# EAGLE design Page1 (EAGLE 4.16)
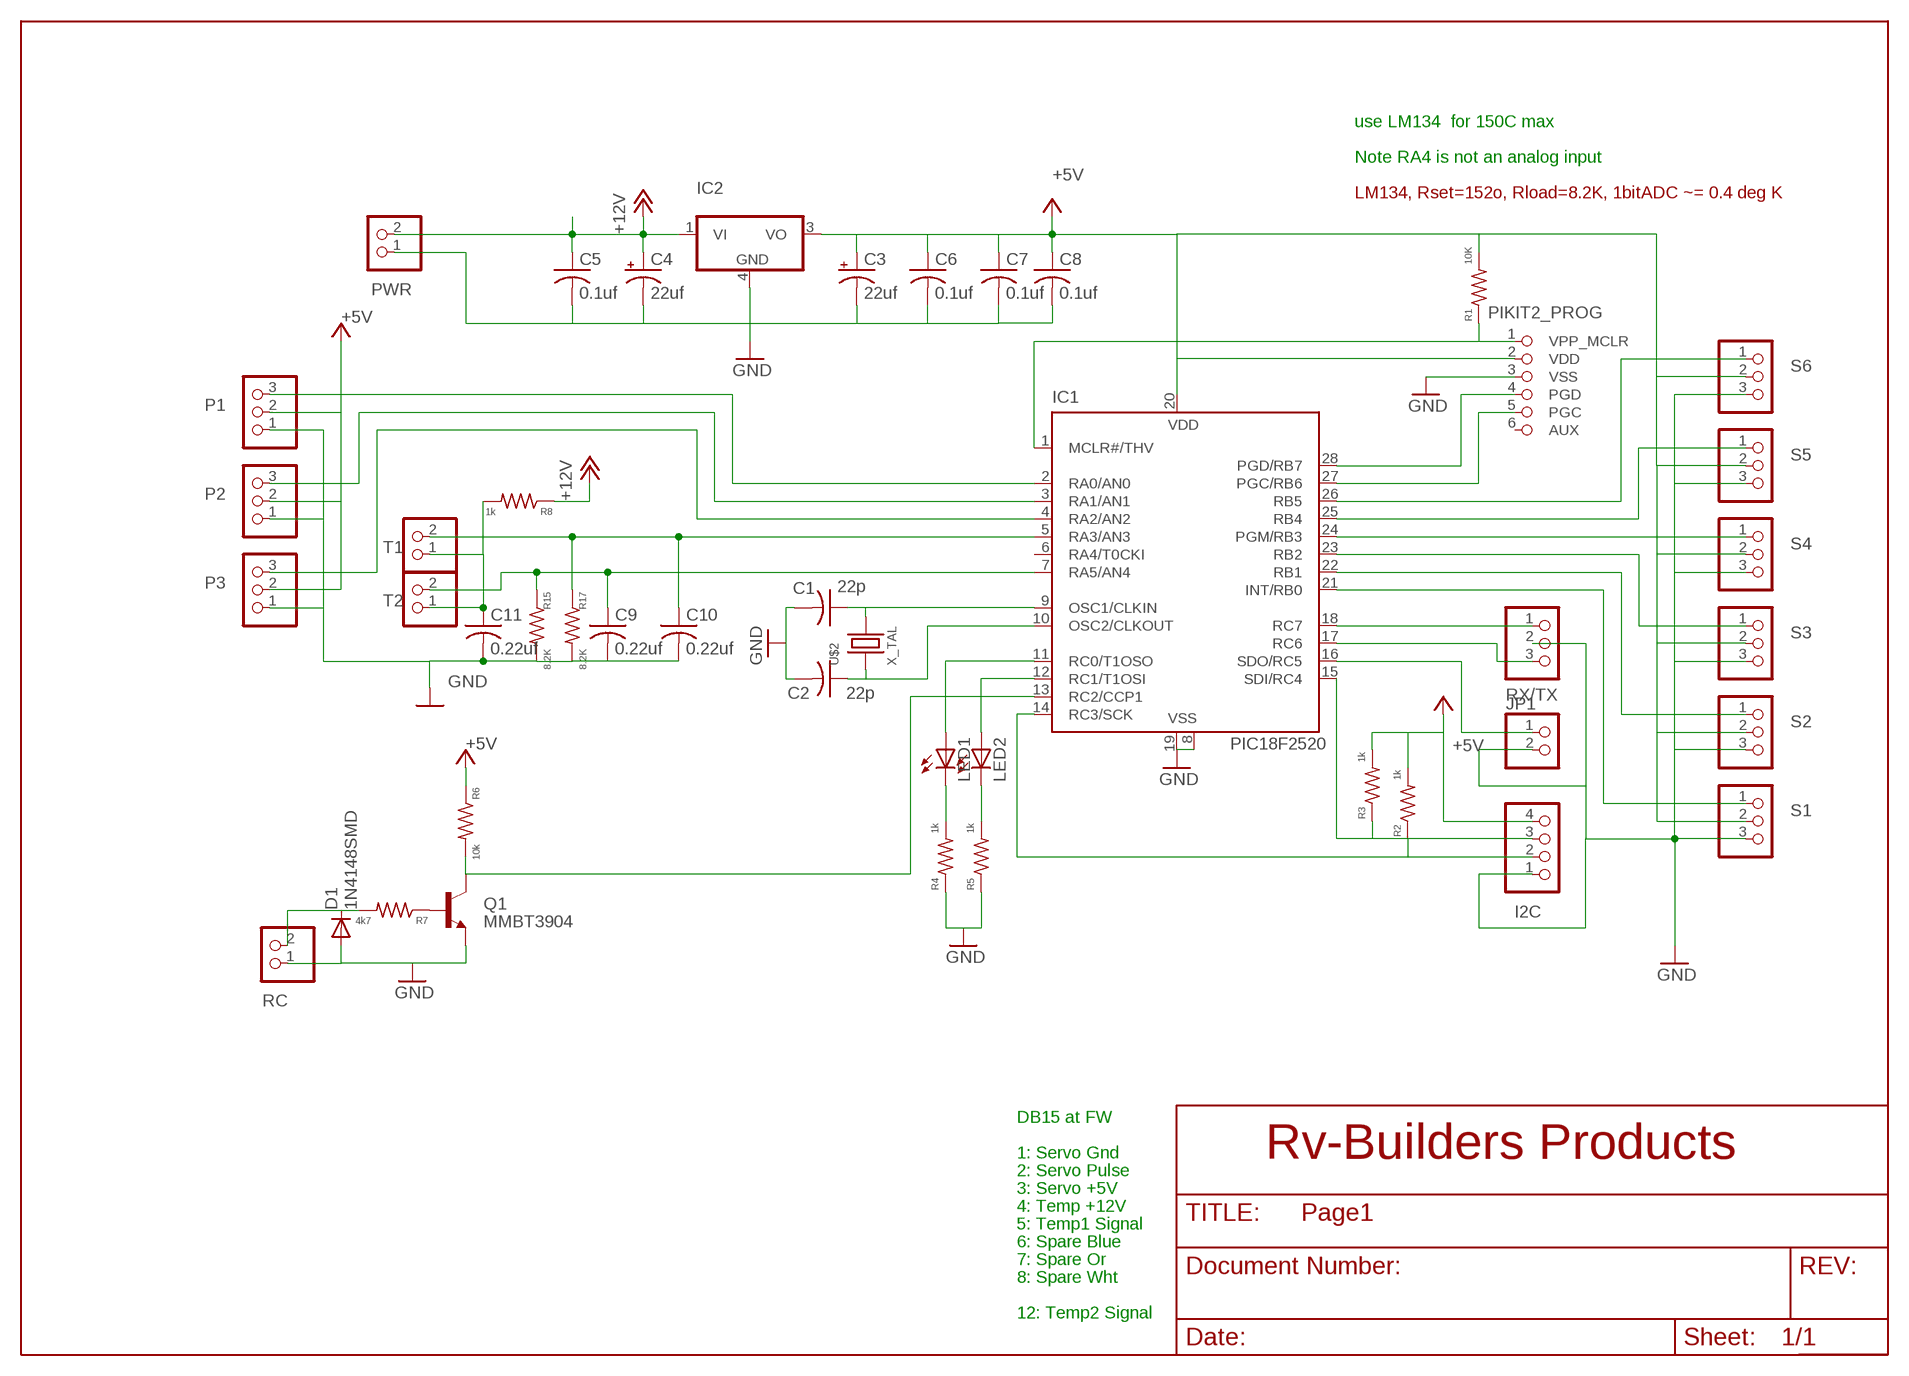
[diagram p0: schematic, sheet 1]

## Parts
C1  22p  C-USC0603  [C0603]
C2  22p  C-USC0603  [C0603]
C3  22uf  CPOL-USSMCD  [SMC_D]
C4  22uf  CPOL-USSMCD  [SMC_D]
C5  0.1uf  C-USC0805  [C0805]
C6  0.1uf  C-USC0805  [C0805]
C7  0.1uf  C-USC0805  [C0805]
C8  0.1uf  C-USC0805  [C0805]
C9  0.22uf  C-USC0805  [C0805]
C10  0.22uf  C-USC0805  [C0805]
C11  0.22uf  C-USC0805  [C0805]
D1  1N4148SMD  [SOD123]
I2C  PINHD-1X4  [1X04]
IC1  PIC18F2520  PIC16876P  [DIL28-3]
IC2  78MXXL  [DPACK]
JP1  PINHD-1X2  [1X02]
LED1  LEDCHIP-LED0805  [CHIP-LED0805]
LED2  LEDCHIP-LED0805  [CHIP-LED0805]
P1  PINHD-1X3  [1X03]
P2  PINHD-1X3  [1X03]
P3  PINHD-1X3  [1X03]
PIKIT2_PROG  PIKIT2_PRG  [1X06]
PWR  PINHD-1X2  [1X02]
Q1  MMBT3904  BC846B-NPN-SOT23-BEC  [SOT23-BEC]
R1  10K  R-US_R0805  [R0805]
R2  1k  R-US_R0603  [R0603]
R3  1k  R-US_R0603  [R0603]
R4  1k  R-US_R0805  [R0805]
R5  1k  R-US_R0805  [R0805]
R6  10k  R-US_R0805  [R0805]
R7  4k7  R-US_R0805  [R0805]
R8  1k  R-US_0207/10  [0207/10]
R15  8.2K  R-US_R0805  [R0805]
R17  8.2K  R-US_R0805  [R0805]
RC  PINHD-1X2  [1X02]
RX/TX  PINHD-1X3  [1X03]
S1  PINHD-1X3  [1X03]
S2  PINHD-1X3  [1X03]
S3  PINHD-1X3  [1X03]
S4  PINHD-1X3  [1X03]
S5  PINHD-1X3  [1X03]
S6  PINHD-1X3  [1X03]
T1  PINHD-1X2  [1X02]
T2  PINHD-1X2  [1X02]
U$2  X_TAL  [HC49/S]

## Nets
+5V: C3.+ C6.1 C7.1 C8.1 I2C.4 IC1.20(VDD) IC2.3(VO) P1.2 P2.2 P3.2 PIKIT2_PROG.2(VDD) R1.2 R2.2 R3.2 R6.1 S1.2 S2.2 S3.2 S4.2 S5.2 S6.2
+12V: C4.+ C5.1 IC2.1(VI) PWR.2 R8.1
GND: C1.2 C2.2 C3.- C4.- C5.2 C6.2 C7.2 C8.2 C9.2 C10.2 C11.2 D1.A I2C.1 IC1.8(VSS) IC1.19(VSS) IC2.4(GND) JP1.2 P1.1 P2.1 P3.1 PIKIT2_PROG.3(VSS) PWR.1 Q1.E R4.1 R5.1 R15.2 R17.2 RC.1 RX/TX.2 S1.3 S2.3 S3.3 S4.3 S5.3 S6.3
N$1: IC1.22(RB1) S2.1
N$2: IC1.28(PGD/RB7) PIKIT2_PROG.4(PGD)
N$3: IC1.27(PGC/RB6) PIKIT2_PROG.5(PGC)
N$4: IC1.23(RB2) S3.1
N$5: IC1.1(MCLR#/THV) PIKIT2_PROG.1(VPP_MCLR) R1.1
N$6: IC1.24(PGM/RB3) S4.1
N$7: LED2.C R5.2
N$8: IC1.21(INT/RB0) S1.1
N$9: LED1.C R4.2
N$10: IC1.25(RB4) S5.1
N$11: IC1.16(SDO/RC5) JP1.1
N$12: IC1.26(RB5) S6.1
N$13: IC1.18(RC7) RX/TX.1
N$14: IC1.17(RC6) RX/TX.3
N$15: IC1.13(RC2/CCP1) Q1.C R6.2
N$16: C1.1 IC1.9(OSC1/CLKIN) U$2.2
N$17: C2.1 IC1.10(OSC2/CLKOUT) U$2.1
N$18: C9.1 IC1.7(RA5/AN4) R15.1 T2.2
N$19: IC1.2(RA0/AN0) P1.3
N$20: C11.1 R8.2 T1.1 T2.1
N$23: I2C.2 IC1.14(RC3/SCK) R2.1
N$24: C10.1 IC1.5(RA3/AN3) R17.1 T1.2
N$25: Q1.B R7.1
N$26: IC1.11(RC0/T1OSO) LED1.A
N$27: IC1.12(RC1/T1OSI) LED2.A
N$30: I2C.3 IC1.15(SDI/RC4) R3.1
N$31: D1.C R7.2 RC.2
N$32: IC1.3(RA1/AN1) P2.3
N$33: IC1.4(RA2/AN2) P3.3
Unconnected: IC1.6(RA4/T0CKI) PIKIT2_PROG.6(AUX)

## Notes on the sheet
- use LM134  for 150C max
- Note RA4 is not an analog input
- LM134, Rset=152o, Rload=8.2K, 1bitADC ~= 0.4 deg K
- DB15 at FW
- 1: Servo Gnd
- 2: Servo Pulse
- 3: Servo +5V
- 4: Temp +12V
- 5: Temp1 Signal
- 6: Spare Blue
- 7: Spare Or
- 8: Spare Wht
- 12: Temp2 Signal

## Library data of the parts
C1 C2 C5-C11 = rcl:C-US: CAPACITOR, American symbol
C3 C4 = rcl:CPOL-US: POLARIZED CAPACITOR, American symbol
D1 = Stofer:1N4148: DIODE high speed (Philips)
I2C = Headers:PINHD-1X4: PIN HEADER
IC1 = microchip:PIC16*876: MICROCONTROLLER flash type
IC2 = Stofer:78MXXL: VOLTAGE REGULATOR
JP1 PWR RC = Headers:PINHD-1X2: PIN HEADER
LED1 LED2 = led:LED: LED OSRAM: - CHIPLED LG R971, LG N971, LY N971, LG Q971, LY Q971, LO R971, LY R971 LH N974, LH R974 LS Q976, LO Q976, LY Q976 LO Q996 - Hyper CHIPLED LW Q18S LB Q993, LB Q99A, LB R99A - SideLED LS A670, LO A670, LY A670, LG A670, LP A670 LB A673, LV A673, LT A673, LW A673 LH A674 LY A675 LS A676, LA A676, LO A676, LY A676, LW A676 LS A679, LY A679, LG A679 - Hyper Micro SIDELED® LS Y876, LA Y876, LO Y876, LY Y876 LT Y87S - SmartLED LW L88C, LW L88S LB L89C, LB L89S, LG L890 LS L89K, LO L89K, LY L89K LS L896, LA L896, LO L896, LY L896 - TOPLED LS T670, LO T670, LY T670, LG T670, LP T670 LSG T670, LSP T670, LSY T670, LOP T670, LYG T670 LG T671, LOG T671, LSG T671 LB T673, LV T673, LT T673, LW T673 LH T674 LS T676, LA T676, LO T676, LY T676, LB T676, LH T676, LSB T676, LW T676 LB T67C, LV T67C, LT T67C, LS T67K, LO T67K, LY T67K, LW E67C LS E67B, LA E67B, LO E67B, LY E67B, LB E67C, LV E67C, LT E67C LW T67C LS T679, LY T679, LG T679 LS T770, LO T770, LY T770, LG T770, LP T770 LB T773, LV T773, LT T773, LW T773 LH T774 LS E675, LA E675, LY E675, LS T675 LS T776, LA T776, LO T776, LY T776, LB T776 LHGB T686 LT T68C, LB T68C - Hyper Mini TOPLED® LB M676 - Mini TOPLED Santana® LG M470 LS M47K, LO M47K, LY M47K Source: http://www.osram.convergy.de - LUMILED® LXK2-PW12-R00, LXK2-PW12-S00, LXK2-PW14-U00, LXK2-PW14-V00 LXK2-PM12-R00, LXK2-PM12-S00, LXK2-PM14-U00 LXK2-PE12-Q00, LXK2-PE12-R00, LXK2-PE12-S00, LXK2-PE14-T00, LXK2-PE14-U00 LXK2-PB12-K00, LXK2-PB12-L00, LXK2-PB12-M00, LXK2-PB14-N00, LXK2-PB14-P00, LXK2-PB14-Q00 LXK2-PR12-L00, LXK2-PR12-M00, LXK2-PR14-Q00, LXK2-PR14-R00 LXK2-PD12-Q00, LXK2-PD12-R00, LXK2-PD12-S00 LXK2-PH12-R00, LXK2-PH12-S00 LXK2-PL12-P00, LXK2-PL12-Q00, LXK2-PL12-R00 Source: www.luxeon.com
P1-P3 = Stofer:PINHD-1X3: PIN HEADER
PIKIT2_PROG = Stofer:PIKIT2_PRG: PIN HEADER
Q1 = transistor:*-NPN-: NPN Transistror
R1-R8 R15 R17 = rcl:R-US_: RESISTOR, American symbol
RX/TX S1-S6 = Headers:PINHD-1X3: PIN HEADER
T1 T2 = Stofer:PINHD-1X2: PIN HEADER
U$2 = Stofer:X_TAL

## Board
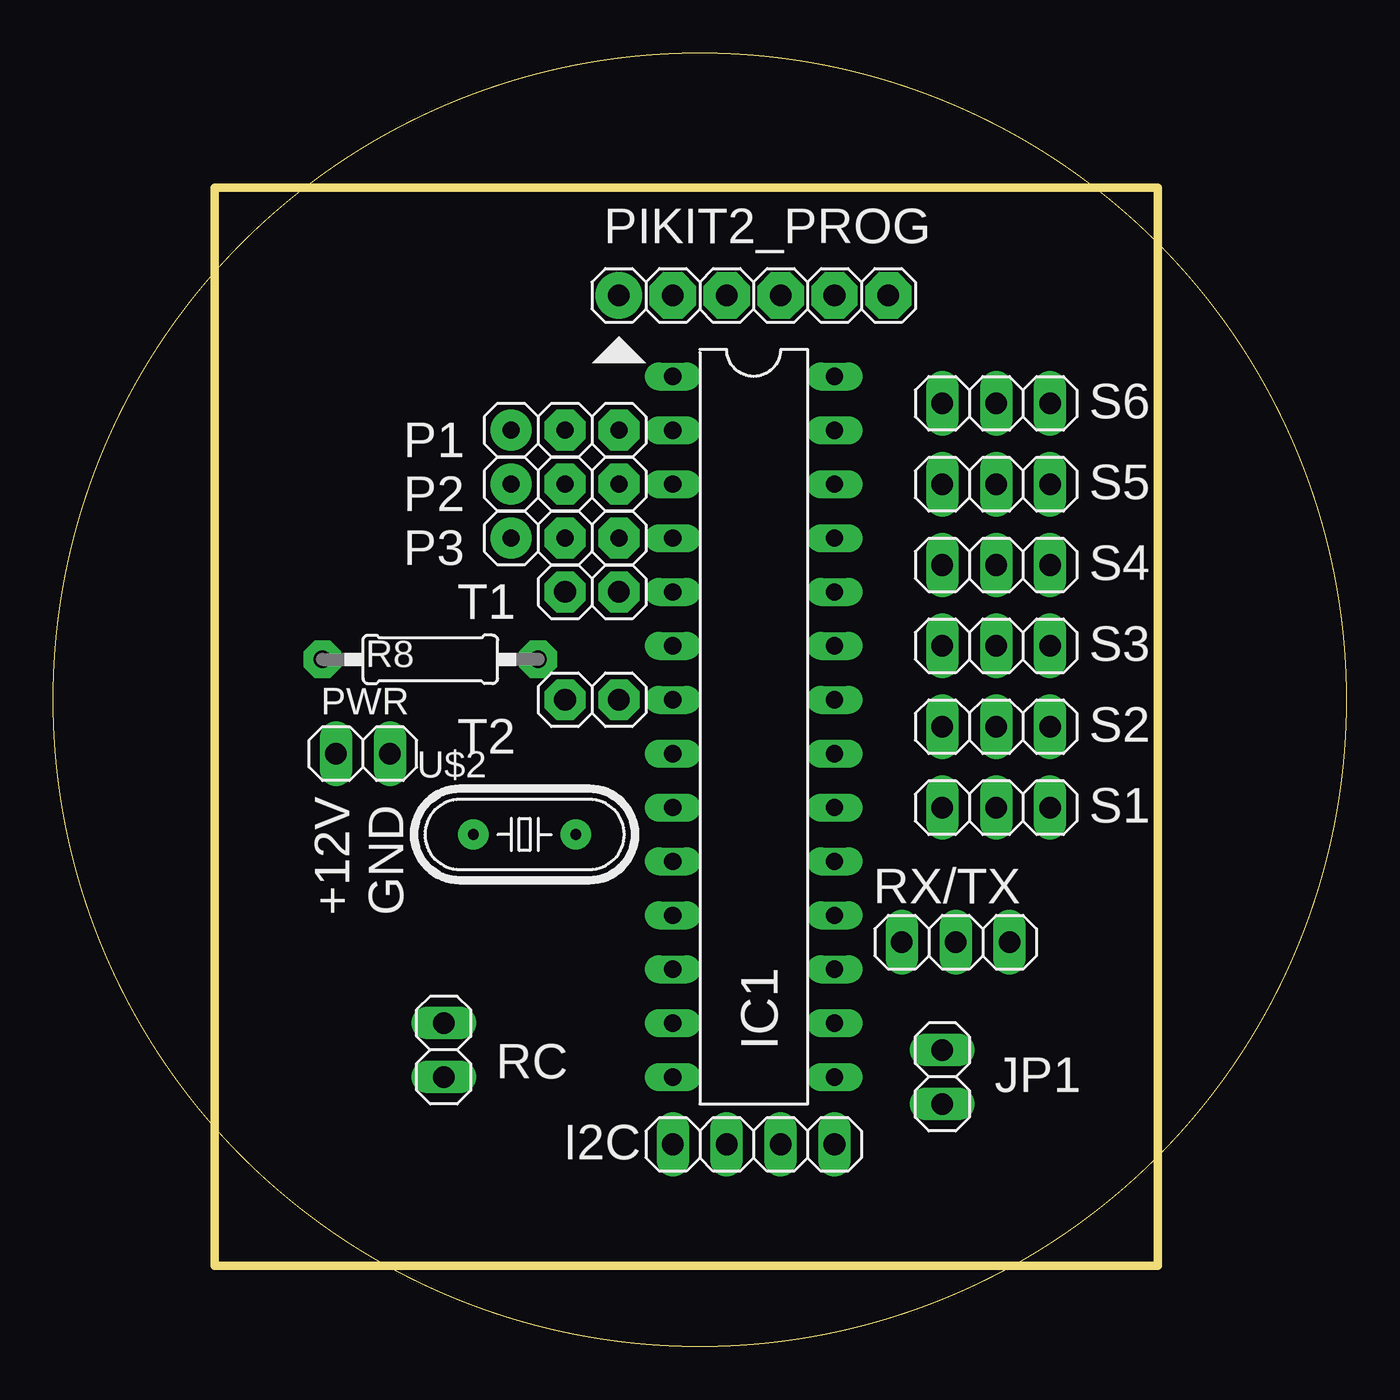
[diagram p1: board, top side]
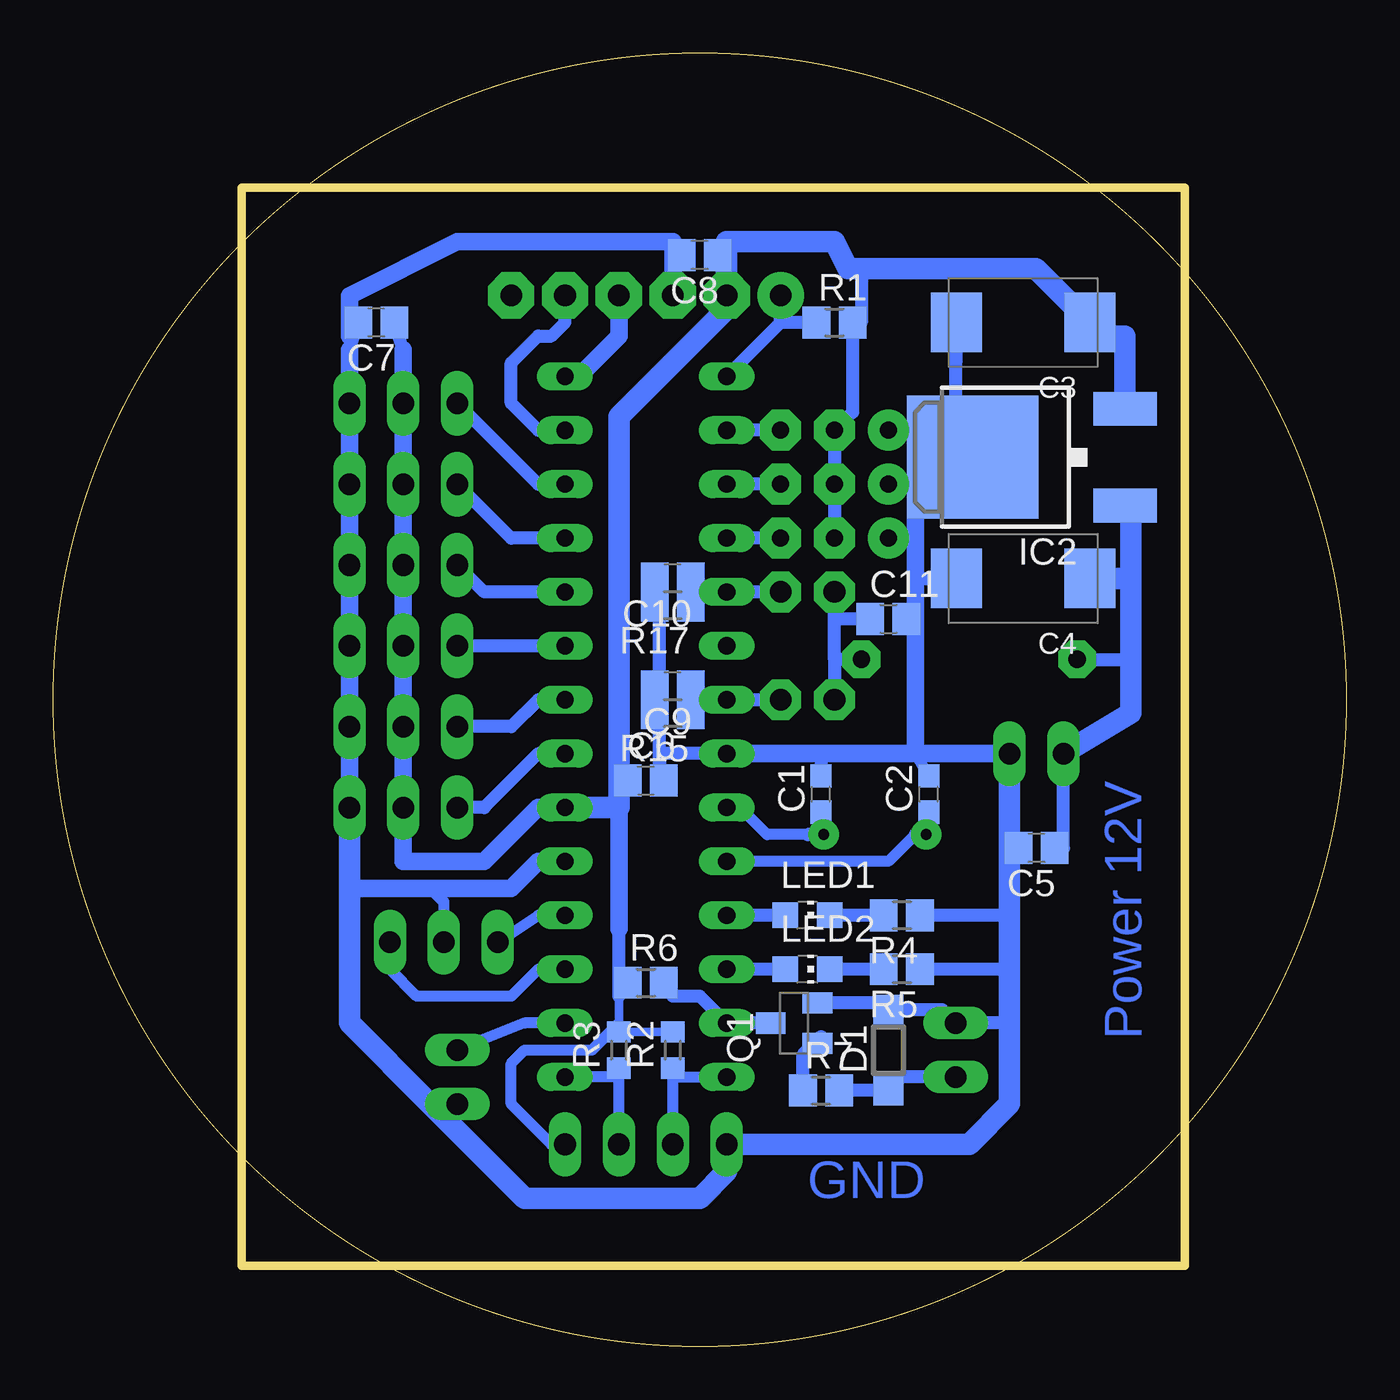
[diagram p2: board, bottom side, seen from below]

Size 60.96 x 60.96 mm. Coordinates in mm from the lower left corner, seen from the top.
Outline: 52.07,3.81 52.07,54.61 7.62,54.61 7.62,3.81 52.07,3.81
Outline: circle at 30.48,30.48 radius 30.48
Copper layers (1*16): Top 0.035mm / dielectric 0.2mm / Bottom 0.035mm
Design rules "default": minimum track width 10mil, minimum drill 20mil, track to track 8mil, track to pad 8mil, pad to pad 8mil, via to via 8mil, smd to smd 8mil, copper to edge 40mil, drill to drill 8mil, minimum pad ring 10mil, minimum via ring 8mil, stop-mask expansion 4mil, vias tented up to drill 0mil, thermal gap 10mil

### Footprints (pad centres in the part's own frame; a part is rotated, then mirrored left to right if it is on the bottom)
C0603 = smd 1.1 x 1: 1 -0.85,0; 2 0.85,0
SMC_D = smd 2.4 x 2.8: + -3.15,0; - 3.15,0
C0805 = smd 1.3 x 1.5: 1 -0.85,0; 2 0.85,0
SOD123 = smd 1.4 x 1.4: A 1.9,0; C -1.9,0
1X04 = drill 1.016 long: 1 -3.81,0; 2 -1.27,0; 3 1.27,0; 4 3.81,0
DIL28-3 = drill 0.813 long: 1 -16.51,-3.81; 2 -13.97,-3.81; 3 -11.43,-3.81; 4 -8.89,-3.81; 5 -6.35,-3.81; 6 -3.81,-3.81; 7 -1.27,-3.81; 8 1.27,-3.81; 9 3.81,-3.81; 10 6.35,-3.81; 11 8.89,-3.81; 12 11.43,-3.81; 13 13.97,-3.81; 14 16.51,-3.81; 15 16.51,3.81; 16 13.97,3.81; 17 11.43,3.81; 18 8.89,3.81; 19 6.35,3.81; 20 3.81,3.81; 21 1.27,3.81; 22 -1.27,3.81; 23 -3.81,3.81; 24 -6.35,3.81; 25 -8.89,3.81; 26 -11.43,3.81; 27 -13.97,3.81; 28 -16.51,3.81
DPACK = smd 1.6 x 3: 1 -2.28,-4.8; 3 2.28,-4.8 | smd 5.8 x 6.2: 4 0,2.38
1X02 = drill 1.016 long: 1 -1.27,0; 2 1.27,0
CHIP-LED0805 = smd 1.2 x 1.2: A 0,-1.05; C 0,1.05
1X03 = drill 0.8 pad 1.93 round: 1 -2.54,0 | drill 0.8 pad 1.93 octagon: 2 0,0; 3 2.54,0
1X06 = drill 1.016 pad 2.184 round: 1 -6.35,0 | drill 1.016 pad 2.184 octagon: 2 -3.81,0; 3 -1.27,0; 4 1.27,0; 5 3.81,0; 6 6.35,0
SOT23-BEC = smd 1 x 1.4: B -0.95,-1.1; C 0,1.1; E 0.95,-1.1
R0805 = smd 1.3 x 1.5: 1 -0.85,0; 2 0.85,0
R0603 = smd 1 x 1.1: 1 -0.85,0; 2 0.85,0
0207/10 = drill 0.813 pad 1.778 octagon: 1 -5.08,0; 2 5.08,0
1X03' = drill 1.016 long: 1 -2.54,0; 2 0,0; 3 2.54,0
1X02' = drill 1.016 pad 1.93 octagon: 1 -1.27,0; 2 1.27,0
HC49/S = drill 0.5 pad 1.422 round: 1 -2.413,0; 2 2.413,0

### Placement (x,y rotation side)
C1  24.76,26.03 90 bottom
C2  19.68,26.03 90 bottom
C3  15.24,48.26 180 bottom
C4  15.24,36.19 180 bottom
C5  14.6,23.49 180 bottom
C6  33.02,26.67 0 bottom
C7  45.72,48.26 180 bottom
C8  30.48,51.44 180 bottom
C9  31.75,31.11 180 bottom
C10  31.75,36.19 180 bottom
C11  21.59,34.29 0 bottom
D1  21.59,13.97 90 bottom
I2C  33.02,9.52 0 top
IC1  33.02,29.21 270 top
IC2  15.24,41.91 90 bottom
JP1  41.91,12.7 270 top
LED1  25.4,20.32 270 bottom
LED2  25.4,17.78 270 bottom
P1  24.13,43.18 0 top
P2  24.13,40.64 0 top
P3  24.13,38.1 0 top
PIKIT2_PROG  33.02,49.53 0 top
PWR  14.6,27.94 180 top
Q1  26.04,15.24 90 bottom
R1  24.13,48.26 0 bottom
R2  31.75,13.97 90 bottom
R3  34.29,13.97 90 bottom
R4  20.96,20.32 180 bottom
R5  20.96,17.78 180 bottom
R6  33.02,17.14 0 bottom
R7  24.76,12.06 0 bottom
R8  17.78,32.38 0 top
R15  31.75,29.84 180 bottom
R17  31.75,34.92 180 bottom
RC  18.41,13.97 270 top
RX/TX  [1X03']  42.55,19.05 0 top
S1  [1X03']  44.45,25.4 0 top
S2  [1X03']  44.45,29.21 0 top
S3  [1X03']  44.45,33.02 0 top
S4  [1X03']  44.45,36.83 0 top
S5  [1X03']  44.45,40.64 0 top
S6  [1X03']  44.45,44.45 0 top
T1  [1X02']  25.4,35.56 0 top
T2  [1X02']  25.4,30.48 0 top
U$2  22.22,24.13 0 top

### Tracks (layer width: path | path; a pad name or v marks a point on that pad's centre or on a via)
+5V
  Bottom 0.406: R6.1 34.29,16.51 34.29,15.24 R3.2 | 34.29,27.94 C6.1 | R3.2 34.29,14.6 | R2.2 31.75,14.6 31.96,14.82 R3.2 | C8.1 29.21,51.44 29.21,52.07
  Bottom 0.508: I2C.4 37.47,9.52 39.37,11.43 39.37,13.33 38.73,13.97 35.56,13.97 34.29,15.24
  Bottom 0.61: 44.45,46.99 C7.1 | 12.06,47.62 11.43,48.26 | 34.29,16.51 34.29,19.68 | P3.2 P2.2 P1.2 23.28,44.03 R1.2 22.86,48.26 22.86,50.8 23.5,50.8
  Bottom 0.813: IC1.20 38.1,25.4 40.64,22.86 44.45,22.86 S1.2 S2.2 S3.2 S4.2 S5.2 S6.2 44.45,46.99 | 34.29,19.68 34.29,25.4 | C3.+ 12.06,47.62 | 29.21,48.89 PIKIT2_PROG.2
  Bottom 1.016: IC1.20 34.29,25.4 34.29,27.94 34.29,43.81 29.21,48.89 | PIKIT2_PROG.2 29.21,52.07 24.13,52.07 23.5,50.8 14.63,50.8 C3.+ | IC2.3 10.44,47.62 12.06,47.62
+12V
  Bottom 0.508: 10.16,39.63 IC2.1 | 10.16,38.1 10.16,37.47
  Bottom 0.61: C5.1 13.33,23.49 PWR.2 | R8.1 10.16,32.38
  Bottom 1.016: 10.16,39.63 10.16,38.1 10.16,36.19 | 10.16,36.19 10.16,32.38 10.16,29.84 PWR.2 | 10.16,36.19 C4.+
GND
  Bottom 0.406: 19.05,42.07 19.05,41.91 | 19.43,42.07 19.05,42.07 | 19.05,42.07 19.05,43.18 | 20.32,40.64 20.32,40.54 20.09,40.54 | C8.2 31.75,51.44 31.75,52.07
  Bottom 0.508: RX/TX.2 42.55,20.95 43.18,21.59 | R5.1 20.32,17.78 | R17.2 32.39,34.92 32.39,36.19 C10.2 | R15.2 32.39,29.84 32.39,31.11 | 20.32,27.94 C2.2
  Bottom 0.61: 22.22,27.94 21.59,27.94 | S2.3 S3.3 | Q1.E 21.9,16.19 D1.A 19.04,15.87 | 46.99,46.99 C7.2 46.99,47.62 | 20.32,40 20.09,40.54 19.43,42.07 18.41,44.45 C3.- | 24.76,27.94 C1.2 | C10.2 32.39,35.56 32.39,34.92 32.39,31.11 | IC1.8 32.39,27.94 32.39,27.3 | C6.2 32.39,26.67 32.39,27.3 | 32.39,30.48 32.39,29.84 | 32.39,30.48 32.39,31.11 | 32.39,31.11 C9.2 | 32.39,27.3 32.39,30.48 | 15.87,17.78 R5.1 | 15.87,15.24 RC.1 19.04,15.87 | 19.04,15.87 19.05,15.87 | 19.05,43.18 P1.1 | 20.32,40.64 P2.1 | 20.32,38.1 P3.1 | 15.87,20.32 R4.1 | 20.32,36.19 C4.- | C5.2 15.87,23.49 15.87,24.76 | C11.2 20.32,34.29 20.32,35.56
  Bottom 0.813: 25.4,27.94 24.76,27.94 | 25.4,27.94 IC1.8 | S1.3 S2.3 S3.3 S4.3 S5.3 S6.3 46.99,46.99 | IC1.19 38.1,22.86 39.37,21.59 43.18,21.59 46.99,21.59 | PIKIT2_PROG.3 31.75,52.07 41.91,52.07 46.99,49.53 46.99,47.62 | IC2.4 18.41,41.91 20.32,40 20.32,38.1 20.32,36.19 20.32,35.56 20.32,27.94 | 20.32,27.94 22.22,27.94 25.4,27.94 | 37.47,6.98 38.1,6.98 | PWR.1 20.32,27.94
  Bottom 1.016: S1.3 46.99,21.59 46.99,15.24 43.18,11.43 | 43.18,11.43 38.73,6.98 37.47,6.98 30.48,6.98 29.21,8.25 I2C.1 17.78,9.52 15.87,11.43 15.87,15.24 15.87,17.78 15.87,20.32 15.87,24.76 PWR.1 | 43.18,11.43 JP1.2
N$1
  Bottom 0.61: IC1.22 38.1,30.48 39.37,29.21 S2.1
N$2
  Bottom 0.813: IC1.28 36.19,45.72 34.29,47.62 PIKIT2_PROG.4
N$3
  Bottom 0.61: IC1.27 38.1,43.18 39.37,44.45 39.37,46.36 38.1,47.62 37.47,47.62 36.83,48.26 PIKIT2_PROG.5
N$4
  Bottom 0.61: IC1.23 S3.1
N$5
  Bottom 0.61: 26.67,48.26 IC1.1 | 26.67,48.26 PIKIT2_PROG.1 | R1.1 26.67,48.26
N$6
  Bottom 0.61: IC1.24 40.64,35.56 S4.1
N$7
  Bottom 0.61: R5.2 LED2.C
N$8
  Bottom 0.61: IC1.21 38.1,27.94 40.64,25.4 S1.1
N$9
  Bottom 0.61: R4.2 LED1.C
N$10
  Bottom 0.61: IC1.25 39.37,38.1 S5.1
N$11
  Bottom 0.508: IC1.16 38.73,15.24 JP1.1
N$12
  Bottom 0.61: IC1.26 38.1,40.64 S6.1
N$13
  Bottom 0.508: RX/TX.1 38.1,20.32 IC1.18
N$14
  Bottom 0.508: IC1.17 38.1,17.78 39.37,16.51 43.81,16.51 45.08,17.78 RX/TX.3
N$15
  Bottom 0.406: R6.2 32.39,17.14 31.75,16.51
  Bottom 0.61: Q1.C IC1.13 30.48,16.51 31.75,16.51
N$16
  Bottom 0.406: 24.76,24.13 C1.1
  Bottom 0.508: IC1.9 28.57,25.4 27.3,24.13 25.4,24.13 24.76,24.13
  Bottom 0.61: U$2.2 25.4,24.13
N$17
  Bottom 0.406: 19.68,24.13 C2.1
  Bottom 0.508: 20.32,24.13 21.59,22.86 IC1.10
  Bottom 0.61: U$2.1 20.32,24.13 19.68,24.13
N$18
  Bottom 0.508: R15.1 31.11,29.84 31.11,30.48 | IC1.7 31.11,30.48 | C9.1 31.11,31.11 31.11,30.48
  Bottom 0.61: T2.2 IC1.7
N$19
  Bottom 0.61: P1.3 IC1.2
N$20
  Bottom 0.61: 24.13,32.38 T1.1 24.13,34.29 C11.1 | R8.2 24.13,32.38 | 24.13,32.38 T2.1
N$23
  Bottom 0.406: 31.75,12.7 R2.1
  Bottom 0.508: IC1.14 31.75,12.7 I2C.2
N$24
  Bottom 0.508: IC1.5 31.11,35.56 31.11,34.92 | 31.11,34.92 R17.1 | C10.1 31.11,36.19 31.11,34.92
  Bottom 0.61: T1.2 IC1.5
N$25
  Bottom 0.61: 24.93,14.43 24.76,14.6 | 24.93,14.43 Q1.B | R7.1 25.61,13.75 24.93,14.43
N$26
  Bottom 0.61: LED1.A IC1.11
N$27
  Bottom 0.61: LED2.A IC1.12
N$30
  Bottom 0.406: 34.29,12.7 R3.1
  Bottom 0.508: IC1.15 34.29,12.7 I2C.3
N$31
  Bottom 0.61: RC.2 20.96,12.7 D1.C 24.12,12.07 24.13,12.06 R7.2
N$32
  Bottom 0.61: P2.3 IC1.3
N$33
  Bottom 0.61: P3.3 IC1.4

### Text on the board
Bottom: Power 12V | GND
tPlace: +12V | GND